# EAGLE design External_Sensor_Board (EAGLE 7.7.0)
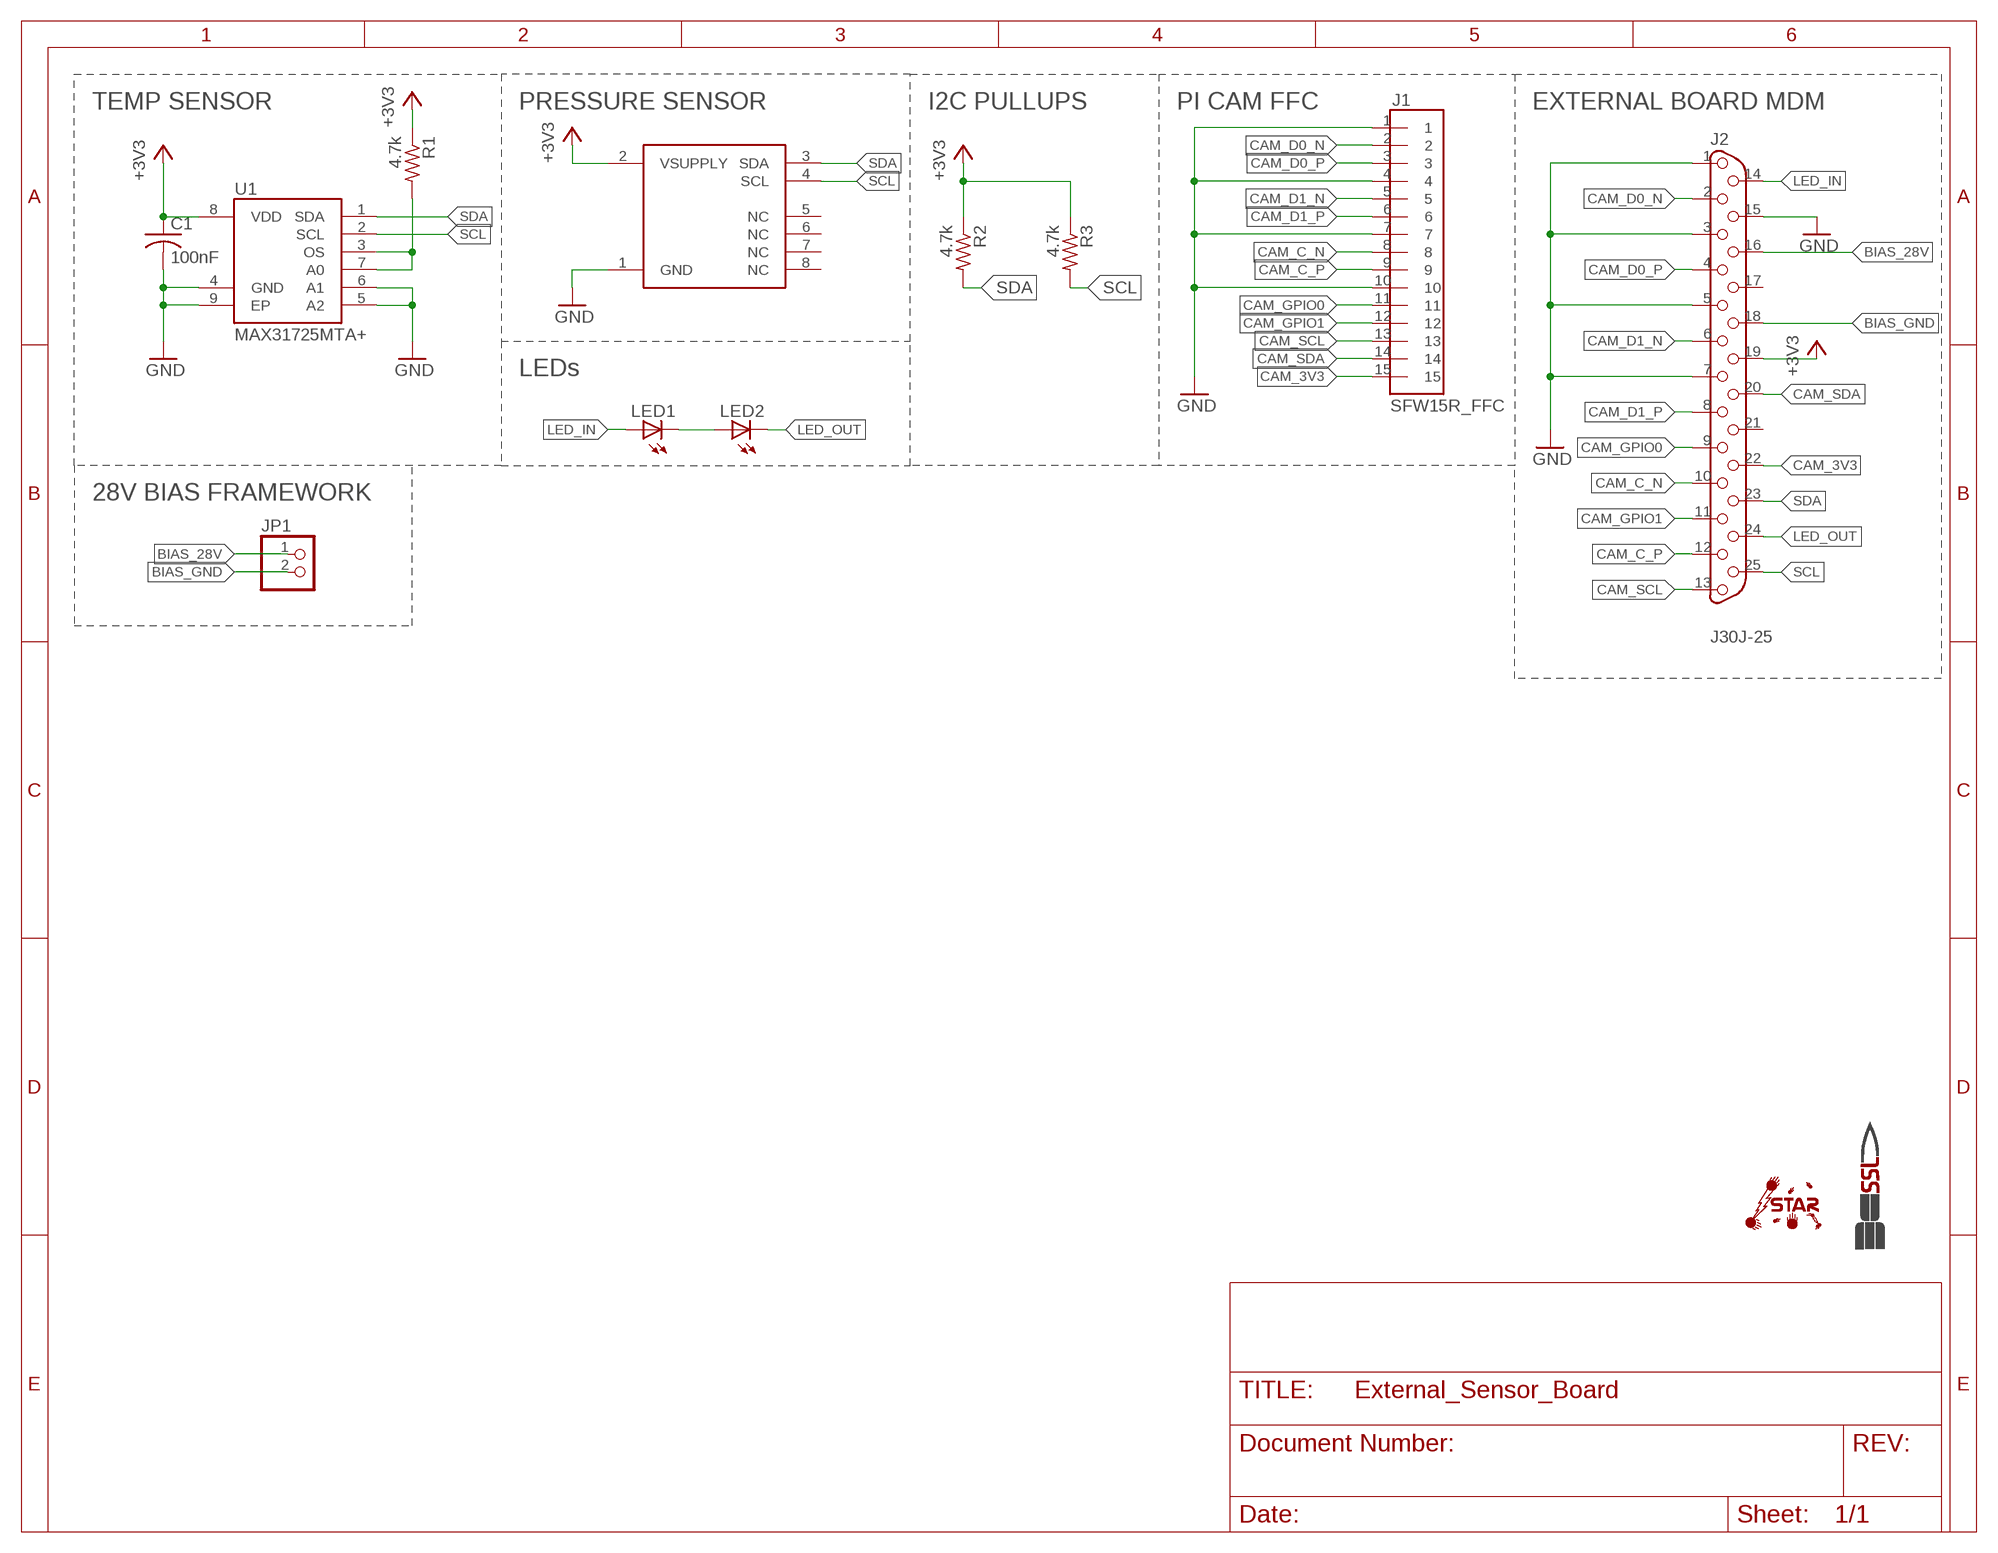
[diagram p0: schematic, sheet 1]

## Parts
C1  100nF  C-USC0603  [C0603]
J1  SFW15R_FFC  [AMPHENOL_15_FFC]
J2  J30J-25  [ZKN-25]
JP1  PINHD-1X2  [1X02]
LED1  LED_1206_NS  [1206_NS]
LED2  LED_1206_NS  [1206_NS]
R1  4.7k  R-US_R0603  [R0603]
R2  4.7k  R-US_R0603  [R0603]
R3  4.7k  R-US_R0603  [R0603]
U1  MAX31725MTA+  [DFN-8]
U2  SSCMNNN015PA2A3  [HSC-SMT-8]
U$1  SSL.3IN_SILK  [SSL_SILK_.3IN]
U$2  STAR  [STAR_.3IN]

## Nets
+3V3: C1.1 J2.19 R1.1 R2.1 R3.1 U1.8(VDD) U2.2(VSUPPLY)
BIAS_28V: J2.16 JP1.1
BIAS_GND: J2.18 JP1.2
CAM_3V3: J1.15 J2.22
CAM_C_N [diff_pair]: J1.8 J2.10
CAM_C_P [diff_pair]: J1.9 J2.12
CAM_D0_N [diff_pair]: J1.2 J2.2
CAM_D0_P [diff_pair]: J1.3 J2.4
CAM_D1_N [diff_pair]: J1.5 J2.6
CAM_D1_P [diff_pair]: J1.6 J2.8
CAM_GPIO0: J1.11 J2.9
CAM_GPIO1: J1.12 J2.11
CAM_SCL: J1.13 J2.13
CAM_SDA: J1.14 J2.20
GND: C1.2 J1.1 J1.4 J1.7 J1.10 J2.1 J2.3 J2.5 J2.7 J2.15 U1.4(GND) U1.5(A2) U1.6(A1) U1.9(EP) U2.1(GND)
LED_IN: J2.14 LED1.2(A)
LED_OUT: J2.24 LED2.1(C)
N$1: R1.2 U1.3(OS) U1.7(A0)
N$2: LED1.1(C) LED2.2(A)
SCL: J2.25 R3.2 U1.2(SCL) U2.4(SCL)
SDA: J2.23 R2.2 U1.1(SDA) U2.3(SDA)
Unconnected: J2.17 J2.21 U2.5(NC) U2.6(NC) U2.7(NC) U2.8(NC)

## Notes on the sheet
- TEMP SENSOR | PRESSURE SENSOR | I2C PULLUPS | PI CAM FFC | EXTERNAL BOARD MDM
- LEDs
- 28V BIAS FRAMEWORK

## Library data of the parts
C1 = resistor:C-US: CAPACITOR, American symbol
J1 = NR_connectors:SFW15R_FFC
J2 = CM_J30J:J30J-25
JP1 = pinhead:PINHD-1X2: PIN HEADER
LED1 LED2 = NR_LED:LED_1206_NS
R1-R3 = resistor:R-US_: RESISTOR, American symbol
U1 = NR_IC:MAX31725MTA+
U2 = NR_IC:SSCMNNN015PA2A3
U$1 = images:SSL
U$2 = images:STAR

## Net classes
0 default: width 0.203 mm, drill 0.33 mm, clearance 0.203 mm
1 diff_pair: width 0.203 mm, drill 0.33 mm, clearance 0.254 mm

## Board
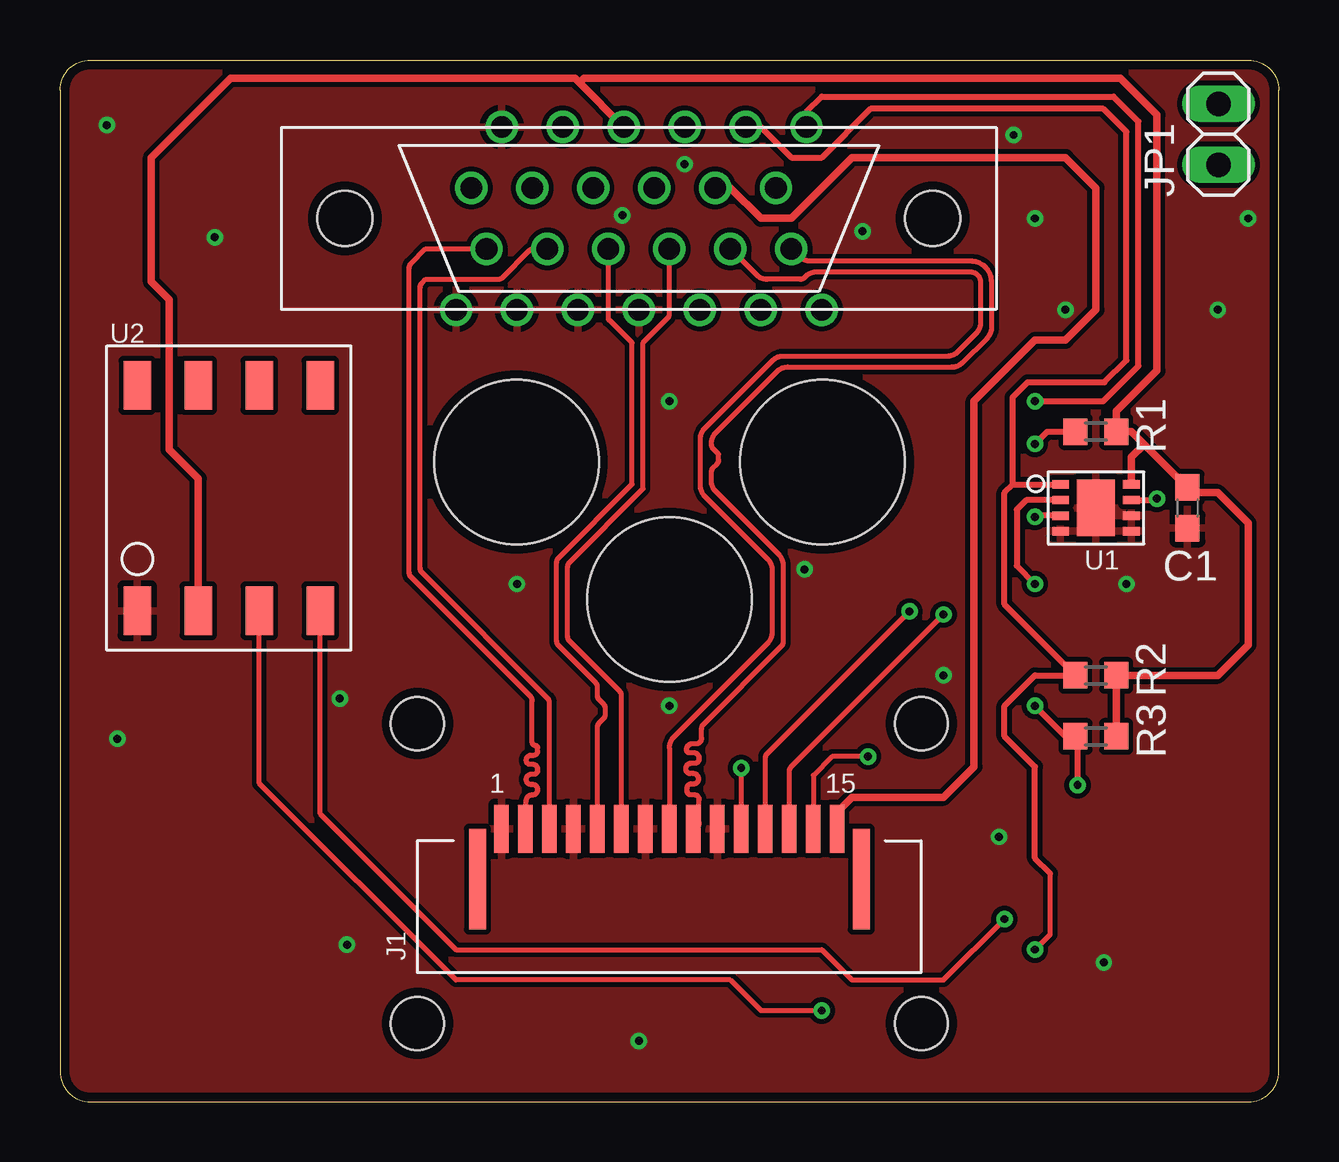
[diagram p1: board, top side]
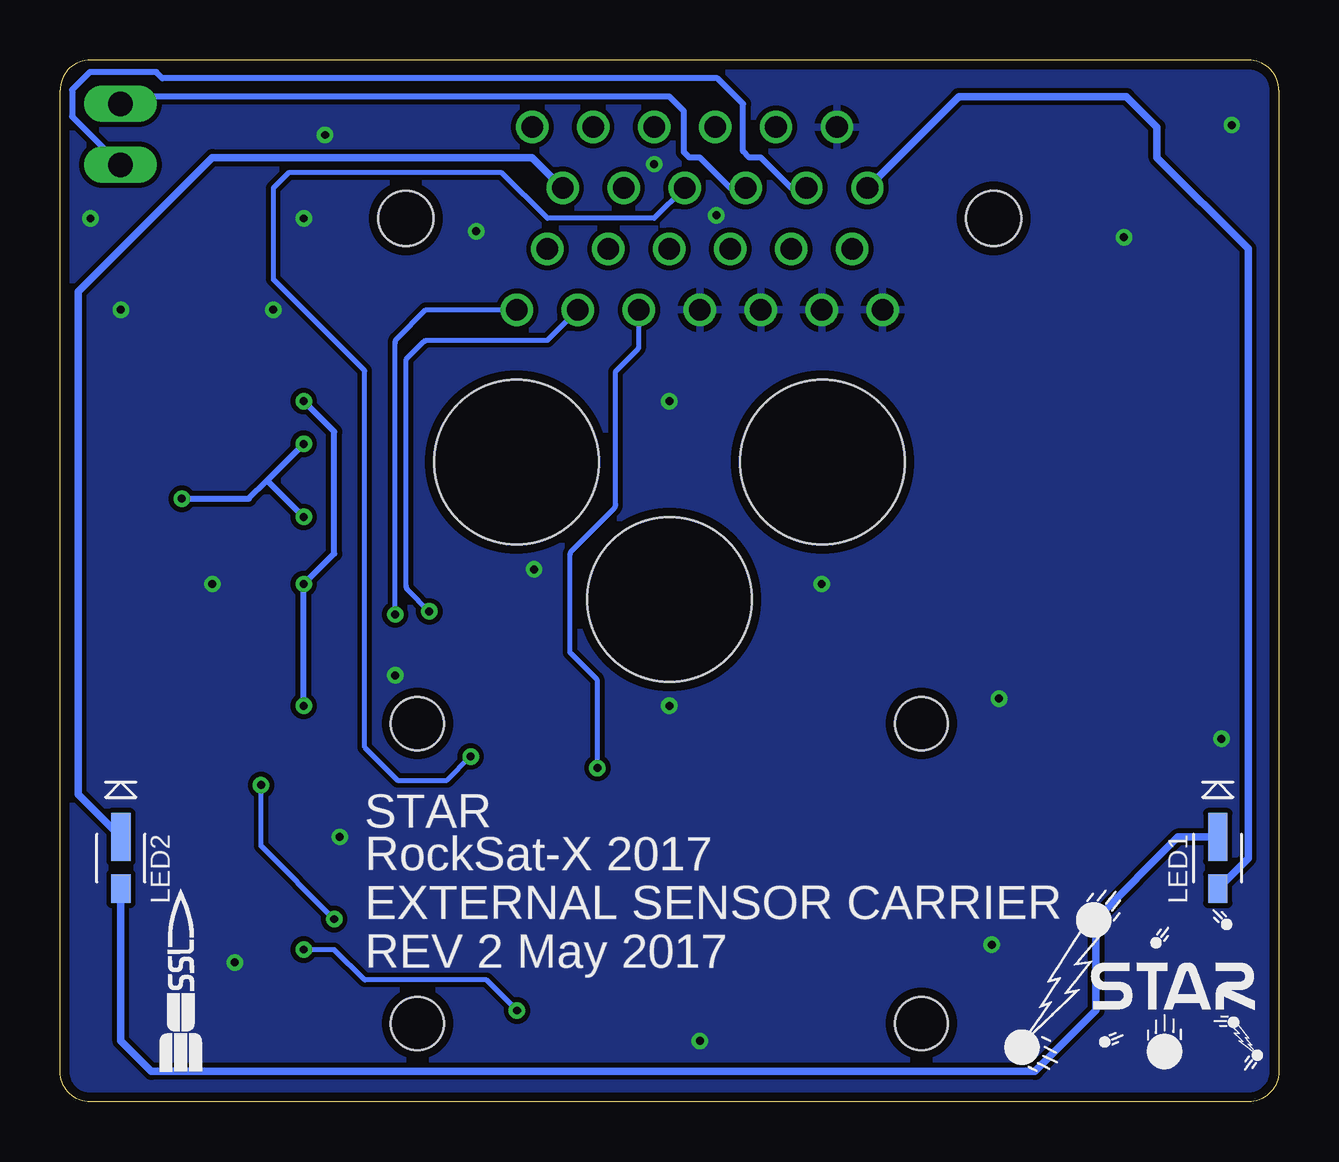
[diagram p2: board, bottom side, seen from below]

Size 50.8 x 43.43 mm. Coordinates in mm from the lower left corner, seen from the top.
Outline: 0,42.16 0,1.27 arc90 1.27,0 49.53,0 arc90 50.8,1.27 50.8,42.16 arc90 49.53,43.43 1.27,43.43 arc90 0,42.16
Copper layers (1*16): Top 0.0356mm / dielectric 1.5011mm / Bottom 0.0356mm
Design rules "oshpark-2layer *": minimum track width 6mil, minimum drill 13mil, track to track 6mil, track to pad 6mil, pad to pad 6mil, via to via 6mil, smd to smd 6mil, copper to edge 15mil, drill to drill 6mil, minimum pad ring 7mil, minimum via ring 7mil, stop-mask expansion 2.5mil, vias tented up to drill 25mil, thermal gap 10mil
Holes 2.2 mm at 14.9,15.77 35.9,15.77 35.9,3.27 14.9,3.27
Holes 6.86 mm at 25.4,20.94 19.02,26.67 31.78,26.67

### Footprints (pad centres in the part's own frame; a part is rotated, then mirrored left to right if it is on the bottom)
C0603 = smd 1.1 x 1: 1 -0.85,0; 2 0.85,0
AMPHENOL_15_FFC = smd 0.6 x 2: 1 -7,2.5; 2 -6,2.5; 3 -5,2.5; 4 -4,2.5; 5 -3,2.5; 6 -2,2.5; 7 -1,2.5; 8 0,2.5; 9 1,2.5; 10 2,2.5; 11 3,2.5; 12 4,2.5; 13 5,2.5; 14 6,2.5; 15 7,2.5 | smd 0.7 x 4.2: SP1 -8,0.4; SP2 8,0.4
ZKN-25 = drill 0.9: 1 -7.62,-3.81; 2 -6.35,-1.27; 3 -5.08,-3.81; 4 -3.81,-1.27; 5 -2.54,-3.81; 6 -1.27,-1.27; 7 0,-3.81; 8 1.27,-1.27; 9 2.54,-3.81; 10 3.81,-1.27; 11 5.08,-3.81; 12 6.35,-1.27; 13 7.62,-3.81; 14 -6.985,1.27; 15 -5.715,3.81; 16 -4.445,1.27; 17 -3.175,3.81; 18 -1.905,1.27; 19 -0.635,3.81; 20 0.635,1.27; 21 1.905,3.81; 22 3.175,1.27; 23 4.445,3.81; 24 5.715,1.27; 25 6.985,3.81 | hole 2.3: -12.25,0; 12.25,0
1X02 = drill 1.016 long: 1 -1.27,0; 2 1.27,0
1206_NS = smd 2 x 0.8: 1 0.88,0 | smd 1.2 x 0.8: 2 -1.27,0
R0603 = smd 1 x 1.1: 1 -0.85,0; 2 0.85,0
DFN-8 = smd 0.7 x 0.35: 1 -1.475,0.975; 2 -1.475,0.325; 3 -1.475,-0.325; 4 -1.475,-0.975; 5 1.475,-0.975; 6 1.475,-0.325; 7 1.475,0.325; 8 1.475,0.975 | smd 1.58 x 2.35: 9 0,0
HSC-SMT-8 = smd 1.143 x 2.032: 1 -3.81,-4.699; 2 -1.27,-4.699; 3 1.27,-4.699; 4 3.81,-4.699; 5 3.81,4.699; 6 1.27,4.699; 7 -1.27,4.699; 8 -3.81,4.699

### Placement (x,y rotation side)
C1  46.99,24.77 270 top
J1  25.4,8.89 0 top
J2  24.13,36.83 0 top
JP1  48.29,40.34 90 top
LED1  2.54,10.16 90 bottom
LED2  48.26,10.16 90 bottom
R1  43.18,27.94 180 top
R2  43.18,17.78 180 top
R3  43.18,15.24 180 top
U1  43.18,24.77 0 top
U2  7.04,25.17 0 top
U$1  46.99,1.27 0 bottom
U$2  11.43,1.27 0 bottom

### Tracks (layer width: path | path; a pad name or v marks a point on that pad's centre or on a via)
+3V3
  Top 0.254: C1.1 46.87,25.74
  Top 0.305: R3.1 R2.1 48.26,17.78 49.53,19.05 49.53,24.13 48.26,25.4 47.2,25.4 C1.1 | 46.87,25.74 45.19,27.41 | 45.19,27.41 44.66,27.94 R1.1 44.03,28.79 45.72,30.48 45.72,41.15 44.2,42.67 21.84,42.67 21.65,42.48 | U1.8 44.66,26.88 45.19,27.41 | 21.65,42.48 21.46,42.67 7.11,42.67 3.81,39.37 3.81,34.19 4.55,33.45 4.55,27.2 5.77,25.98 U2.2 | 21.65,42.48 J2.19
BIAS_28V
  Bottom 0.254: J2.16 20.32,38.1 21.59,39.37 22.07,39.37 22.33,39.62 22.33,41.6 23.39,42.67 46.53,42.67 46.79,42.93 49.55,42.93 50.29,42.19 50.29,41.07 JP1.1
BIAS_GND
  Bottom 0.254: J2.18 22.86,38.1 24.13,39.37 24.56,39.37 24.79,39.6 24.79,41.3 25.4,41.91 47.98,41.91 JP1.2
CAM_3V3
  Top 0.305: J1.15 32.4,12.08 33.02,12.7 36.83,12.7 38.1,13.97 38.1,29.21 40.64,31.75 41.91,31.75 43.18,33.02 43.18,38.1 41.91,39.37 33.02,39.37 30.48,36.83 29.21,36.83 27.94,38.1 J2.22
CAM_C_N
  Top 0.203: J1.8 25.4,14.77 arc-45 25.59,15.22 29.51,19.14 arc45 29.69,19.59 29.69,22.17 arc45 29.51,22.62 26.88,25.25 arc-45 26.7,25.7 26.7,27.64 arc-45 26.88,28.09 29.69,30.9 arc-45 30.14,31.09 36.98,31.09 arc45 37.43,31.28 38.19,32.04 arc45 38.38,32.49 38.38,34.16 arc90 37.95,34.59 31.53,34.59 arc45 31.08,34.41 31.04,34.37 arc-45 30.86,34.29 29.47,34.29 arc-45 29.02,34.48 J2.10
CAM_C_P
  Top 0.203: J2.12 30.8,35.24 arc45 31.25,35.05 37.95,35.05 arc-90 38.84,34.16 38.84,32.3 arc-45 38.65,31.85 37.62,30.82 arc-45 37.17,30.63 30.33,30.63 arc45 29.88,30.45 27.34,27.9 arc45 27.15,27.46 27.15,27.41 arc45 27.23,27.23 27.46,27 27.46,26.78 arc-45 27.38,26.6 27.23,26.44 arc45 27.15,26.26 27.15,25.89 arc45 27.34,25.44 29.96,22.81 arc-45 30.15,22.36 30.15,19.18 arc-45 30.07,19 26.82,15.75 arc45 26.75,15.57 26.75,15.16 arc-90 26.52,14.94 26.36,14.94 arc90 26.11,14.68 arc90 26.24,14.55 26.42,14.55 arc-90 26.64,14.33 26.64,14.3 arc-90 26.47,14.12 26.31,14.12 arc90 26.09,13.89 26.09,13.87 arc90 26.26,13.69 26.39,13.69 arc-90 26.62,13.46 arc-90 26.42,13.26 26.31,13.26 arc90 26.14,13.08 26.14,12.95 arc90 26.29,12.8 26.44,12.8 arc-90 26.64,12.6 26.64,11.63 arc-90 J1.9
CAM_D0_N
  Top 0.203: J2.2 15.24,35.56 14.63,34.95 arc45 14.55,34.77 14.55,22.06 arc45 14.63,21.88 19.61,16.9 arc-45 19.68,16.72 19.68,14.99 arc90 19.81,14.86 arc-90 19.91,14.76 19.91,14.63 arc-90 19.74,14.45 19.63,14.45 arc90 19.43,14.25 arc90 19.61,14.07 19.71,14.07 arc-90 19.91,13.87 19.91,13.82 arc-90 19.76,13.67 19.66,13.67 arc90 19.43,13.44 arc90 19.63,13.23 19.71,13.23 arc-90 19.91,13.03 19.91,13.01 arc-90 19.71,12.8 19.68,12.8 arc90 19.43,12.55 19.43,11.39 J1.2
CAM_D0_P
  Top 0.203: J1.3 20.4,16.65 arc45 20.33,16.83 15.09,22.07 arc-45 15.01,22.25 15.01,33.96 arc-45 15.09,34.14 15.24,34.29 18.26,34.29 arc45 18.44,34.36 19.56,35.49 arc-45 19.74,35.56 J2.4
CAM_D1_N
  Top 0.203: J2.6 22.86,32.61 arc45 22.93,32.56 23.85,31.65 23.85,25.75 20.77,22.67 arc45 20.7,22.49 20.7,19.21 arc45 20.77,19.03 22.33,17.48 arc-45 22.4,17.3 22.4,16.95 arc45 22.47,16.77 22.66,16.58 arc-45 22.73,16.41 22.73,16.16 arc-45 22.66,15.98 22.47,15.79 arc45 22.4,15.62 J1.5
CAM_D1_P
  Top 0.203: J1.6 23.4,16.95 arc45 23.33,17.13 21.23,19.22 arc-45 21.16,19.4 21.16,22.3 arc-45 21.23,22.48 24.31,25.56 24.31,31.65 25.33,32.67 arc45 25.4,32.85 J2.8
CAM_GPIO0  (via drill 0.33)
  Top 0.203: J1.11 v28.4,13.91 arc45 v28.4,13.92
  Bottom 0.203: v28.4,13.92 28.4,17.5 arc-45 28.47,17.68 29.54,18.75 29.54,22.81 arc45 29.47,22.99 27.71,24.74 arc-45 27.64,24.92 27.64,30.46 26.74,31.35 arc-45 26.67,31.53 J2.9
CAM_GPIO1  (via drill 0.33)
  Top 0.203: J1.12 29.4,14.33 arc-45 29.47,14.51 v35.41,20.45
  Bottom 0.203: v35.41,20.45 36.3,21.34 arc45 36.37,21.52 36.37,30.96 35.66,31.68 arc45 35.48,31.75 30.48,31.75 J2.11
CAM_SCL  (via drill 0.33)
  Top 0.203: J1.13 30.4,13.78 arc-45 30.47,13.96 v36.83,20.32
  Bottom 0.203: v36.83,20.32 36.83,31.64 arc45 36.76,31.82 35.56,33.02 J2.13
CAM_SDA  (via drill 0.33)
  Top 0.203: v33.68,14.4 32.18,14.4 31.4,13.62 J1.14
  Bottom 0.203: J2.20 26.04,36.83 30.48,36.83 32.38,38.73 41.27,38.73 41.91,38.1 41.91,34.29 38.1,30.48 38.1,14.78 36.73,13.41 34.67,13.41 v33.68,14.4
GND  (via drill 0.33)
  other vias: 49.53,36.83 44.45,21.59 36.83,17.78 41.91,33.02 19.05,21.59 25.4,16.51 31.04,22.2 40.64,36.83 1.96,40.72 6.45,36.04 2.39,15.14 11.66,16.81 11.96,6.55 43.51,5.82 39.14,11.05 48.26,33.02 25.4,29.21 26.04,39.09 23.44,36.96 33.45,36.3 39.75,40.31 24.13,2.54
  pour Bottom: 1.27,43.43 49.53,43.43 arc-90 50.8,42.16 50.8,1.27 arc-90 49.53,0 1.27,0 arc-90 0,1.27 0,42.16 arc-90
  pour Top: 1.27,43.43 49.53,43.43 arc-90 50.8,42.16 50.8,1.27 arc-90 49.53,0 1.27,0 arc-90 0,1.27 0,42.16 arc-90
LED_IN
  Bottom 0.305: LED1.2 1.27,10.16 1.27,35.56 5.08,39.37 5.08,40.64 6.35,41.91 13.34,41.91 J2.14
LED_OUT
  Bottom 0.305: LED2.1 50.04,12.82 50.04,33.78 44.45,39.37 31.11,39.37 J2.24
N$1  (via drill 0.33)
  Top 0.254: U1.7 45.66,25.09 v45.72,25.15 | v40.64,27.43 41.15,27.94 R1.2 | U1.3 40.7,24.44 v40.64,24.38
  Bottom 0.254: v45.72,25.15 42.93,25.15 42.16,25.91 | 42.16,25.91 v40.64,27.43 | v40.64,24.38 42.16,25.91
N$2
  Bottom 0.305: LED1.1 4.2,11.04 7.62,7.62 7.62,3.81 10.16,1.27 46.99,1.27 48.26,2.54 LED2.2
SCL  (via drill 0.33)
  Top 0.203: v39.37,7.62 36.83,5.08 33.02,5.08 31.75,6.35 16.51,6.35 10.85,12.01 U2.4
  Top 0.254: 41.65,25.15 U1.2 40.28,25.09 39.88,24.69 39.88,22.35 v40.64,21.59 | v40.64,16.51 41.91,15.24 R3.2 42.42,15.15 v42.42,13.21 | v40.64,29.21 43.48,29.21 44.96,30.68 44.96,40.87 43.92,41.91 31.75,41.91 31.11,41.27 J2.25
  Bottom 0.203: v39.37,7.62 42.42,10.67 v42.42,13.21
  Bottom 0.254: v40.64,16.51 v40.64,21.59 39.37,22.86 39.37,27.94 v40.64,29.21
SDA  (via drill 0.33)
  Top 0.203: v31.75,3.81 29.21,3.81 27.94,5.08 16.51,5.08 8.31,13.28 U2.3 | v40.64,6.35 41.27,6.98 41.27,9.53
  Top 0.254: 39.71,25.74 39.37,25.4 39.37,20.74 R2.2 40.64,17.78 39.37,16.51 39.37,15.24 40.64,13.97 40.64,10.16 41.27,9.53 | 39.71,25.74 U1.1 | 39.71,25.74 39.71,29.37 40.34,30 43.54,30 44.45,30.91 44.45,40.44 43.48,41.4 33.78,41.4 31.75,39.37 30.48,39.37 29.21,40.64 J2.23
  Bottom 0.203: v31.75,3.81 33.02,5.08 38.1,5.08 39.37,6.35 v40.64,6.35

### Text on the board
bPlace: STAR | RockSat-X 2017 | EXTERNAL SENSOR CARRIER | REV 2 May 2017
tDocu: I2C PULLUPS | OPTIONAL